# EAGLE design Gadget-Box-PiZero (EAGLE 6.6.0)
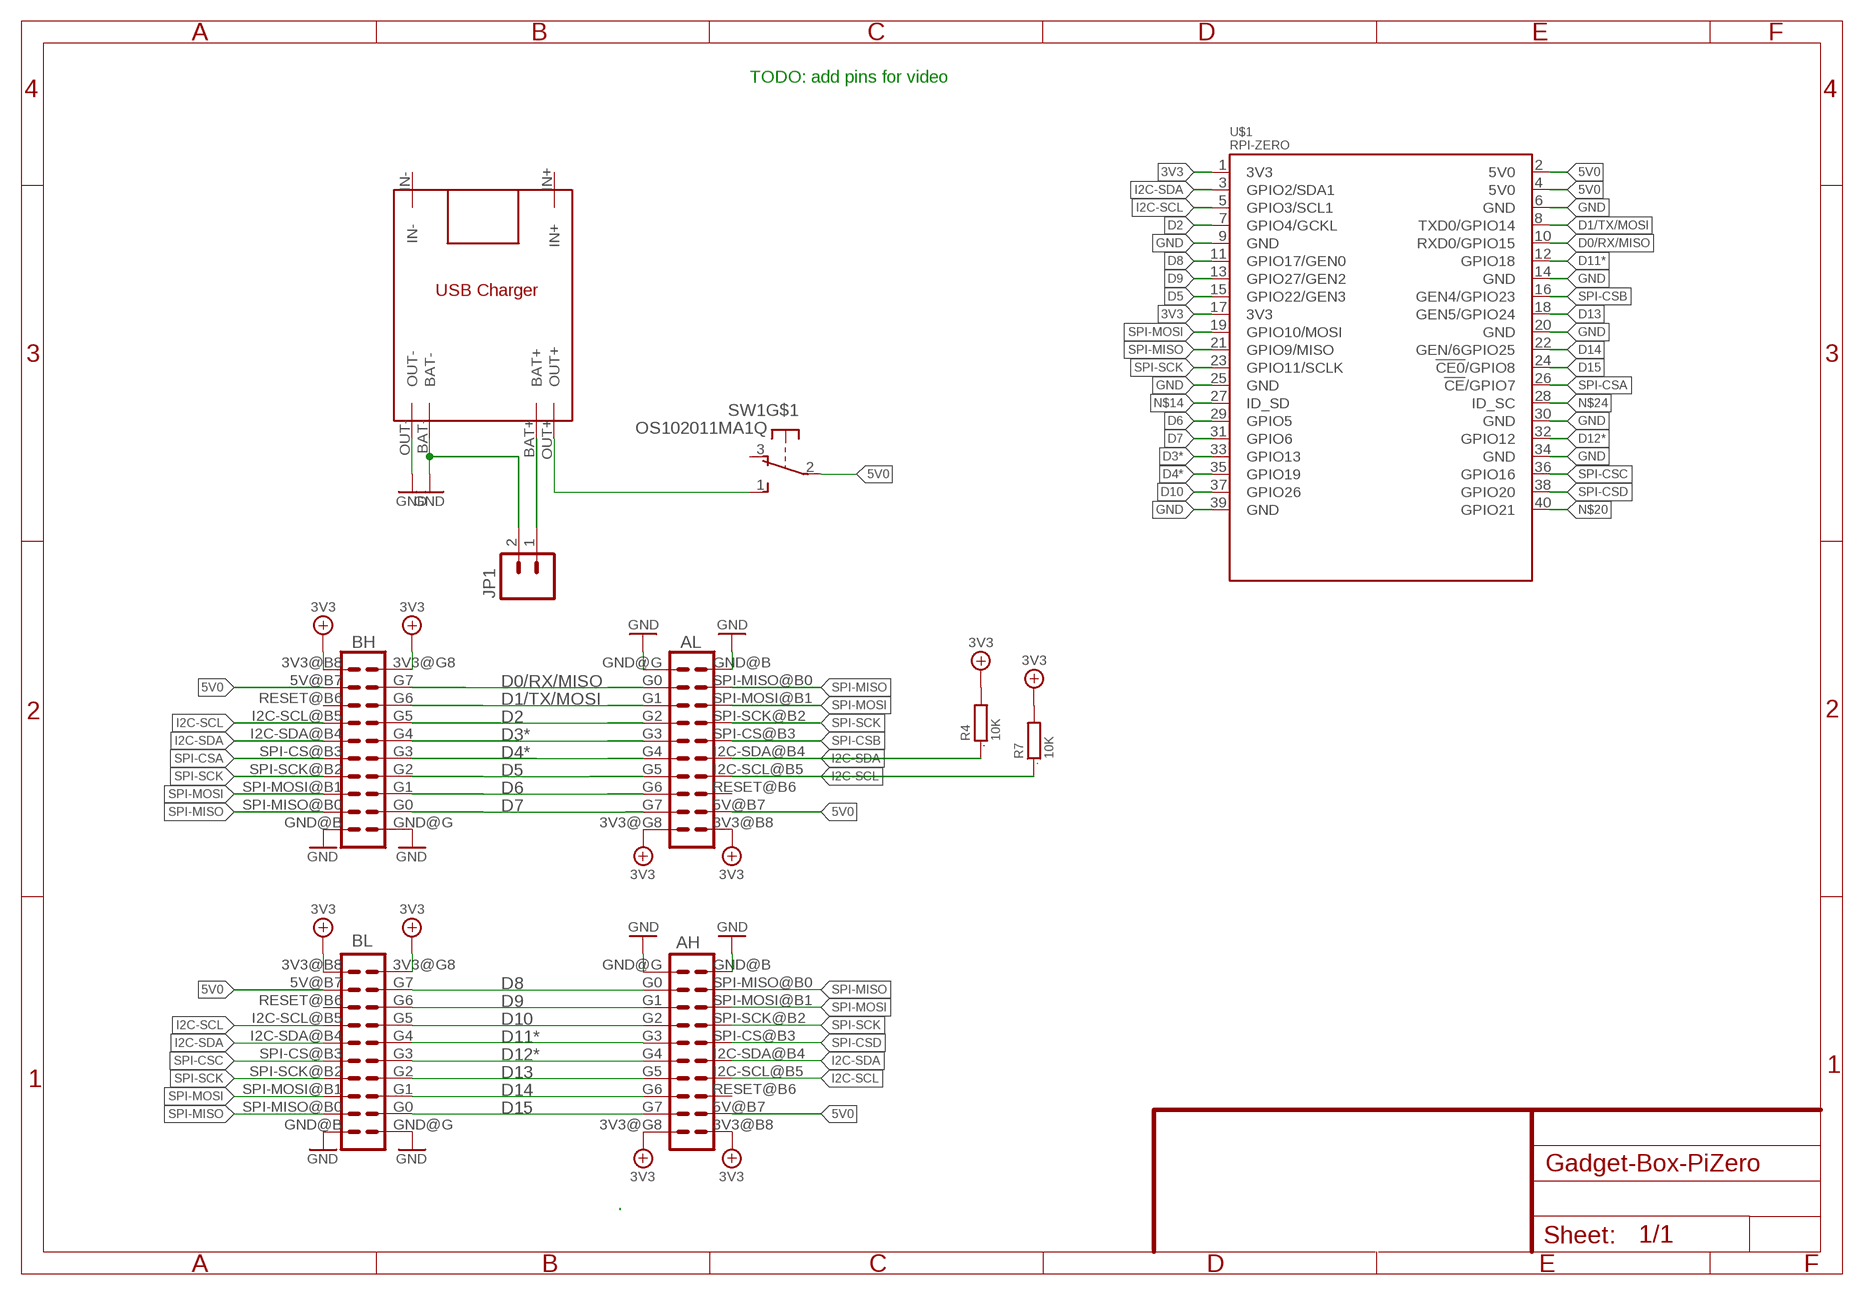
[diagram p0: schematic, sheet 1]

## Parts
AH  ECOGECOG_SLOT_ALT1  [ECOG_ALT1]
AL  ECOGECOG_SLOT_ALT1  [ECOG_ALT1]
BH  ECOGECOG_SLOT_ALT1  [ECOG_ALT1]
BL  ECOGECOG_SLOT_ALT1  [ECOG_ALT1]
JP1  M02-JST-2-PTH-NO_SILK  [JST-2-PTH-NS]
R4  10K  R0603  [0603]
R7  10K  R0603  [0603]
SW1  OS102011MA1Q  [OS102011MA1Q]
U$1  RPI-ZERO  [RASPBERRYPI_BASTELSTUBE_V13_RASPI_BOARD_B+_FULL]
U$2  TP4056  [TP4056]

## Nets
3V3: AH.3V3@B8(3V3) AH.3V3@G8(3V3) AL.3V3@B8(3V3) AL.3V3@G8(3V3) BH.3V3@B8(3V3) BH.3V3@G8(3V3) BL.3V3@B8(3V3) BL.3V3@G8(3V3) R4.2 R7.2 U$1.1(3V3) U$1.17(3V3)
5V0: AH.5V@B7(5V) AL.5V@B7(5V) BH.5V@B7(5V) BL.5V@B7(5V) SW1.2(P) U$1.2(5V0) U$1.4(5V0)
D0/RX/MISO: AL.G0 BH.G7 U$1.10(RXD0/GPIO15)
D1/TX/MOSI: AL.G1 BH.G6 U$1.8(TXD0/GPIO14)
D2: AL.G2 BH.G5 U$1.7(GPIO4/GCKL)
D3*: AL.G3 BH.G4 U$1.33(GPIO13)
D4*: AL.G4 BH.G3 U$1.35(GPIO19)
D5: AL.G5 BH.G2 U$1.15(GPIO22/GEN3)
D6: AL.G6 BH.G1 U$1.29(GPIO5)
D7: AL.G7 BH.G0 U$1.31(GPIO6)
D8: AH.G0 BL.G7 U$1.11(GPIO17/GEN0)
D9: AH.G1 BL.G6 U$1.13(GPIO27/GEN2)
D10: AH.G2 BL.G5 U$1.37(GPIO26)
D11*: AH.G3 BL.G4 U$1.12(GPIO18)
D12*: AH.G4 BL.G3 U$1.32(GPIO12)
D13: AH.G5 BL.G2 U$1.18(GEN5/GPIO24)
D14: AH.G6 BL.G1 U$1.22(GEN/6GPIO25)
D15: AH.G7 BL.G0 U$1.24(!CE0!/GPIO8)
GND [gnd]: AH.GND@B(GND) AH.GND@G(GND) AL.GND@B(GND) AL.GND@G(GND) BH.GND@B(GND) BH.GND@G(GND) BL.GND@B(GND) BL.GND@G(GND) JP1.2 U$1.6(GND) U$1.9(GND) U$1.14(GND) U$1.20(GND) U$1.25(GND) U$1.30(GND) U$1.34(GND) U$1.39(GND) U$2.BAT- U$2.OUT-
I2C-SCL: AH.I2C-SCL@B5(I2C-SCL) AL.I2C-SCL@B5(I2C-SCL) BH.I2C-SCL@B5(I2C-SCL) BL.I2C-SCL@B5(I2C-SCL) R7.1 U$1.5(GPIO3/SCL1)
I2C-SDA: AH.I2C-SDA@B4(I2C-SDA) AL.I2C-SDA@B4(I2C-SDA) BH.I2C-SDA@B4(I2C-SDA) BL.I2C-SDA@B4(I2C-SDA) R4.1 U$1.3(GPIO2/SDA1)
N$2: JP1.1 U$2.BAT+
N$3: SW1.1(S) U$2.OUT+
N$14: U$1.27(ID_SD)
N$20: U$1.40(GPIO21)
N$24: U$1.28(ID_SC)
SPI-CSA: BH.SPI-CS@B3(SPI-CS) U$1.26(!CE!/GPIO7)
SPI-CSB: AL.SPI-CS@B3(SPI-CS) U$1.16(GEN4/GPIO23)
SPI-CSC: BL.SPI-CS@B3(SPI-CS) U$1.36(GPIO16)
SPI-CSD: AH.SPI-CS@B3(SPI-CS) U$1.38(GPIO20)
SPI-MISO: AH.SPI-MISO@B0(SPI-MISO) AL.SPI-MISO@B0(SPI-MISO) BH.SPI-MISO@B0(SPI-MISO) BL.SPI-MISO@B0(SPI-MISO) U$1.21(GPIO9/MISO)
SPI-MOSI: AH.SPI-MOSI@B1(SPI-MOSI) AL.SPI-MOSI@B1(SPI-MOSI) BH.SPI-MOSI@B1(SPI-MOSI) BL.SPI-MOSI@B1(SPI-MOSI) U$1.19(GPIO10/MOSI)
SPI-SCK: AH.SPI-SCK@B2(SPI-SCK) AL.SPI-SCK@B2(SPI-SCK) BH.SPI-SCK@B2(SPI-SCK) BL.SPI-SCK@B2(SPI-SCK) U$1.23(GPIO11/SCLK)
Unconnected: AH.RESET@B6(RESET) AL.RESET@B6(RESET) BH.RESET@B6(RESET) BL.RESET@B6(RESET) SW1.3(O) SW1.MT1(MT) SW1.MT2(MT) U$2.IN+ U$2.IN-

## Notes on the sheet
- TODO: add pins for video

## Library data of the parts
AH AL BH BL = eCogs:ECOG; PARTNO: PPPC102LFBN-RC,SULLINS CONNECTOR SOLUTIONS,dk,S6106-ND,"CONN HEADER FEM 20POS.1"" DL GOLD", REF67
JP1 = SparkFun:M02: Header 2 Standard 2-pin 0.1" header. Use with straight break away headers (SKU : PRT-00116), right angle break away headers (PRT-00553), swiss pins (PRT-00743), machine pins (PRT-00117), and female headers (PRT-00115). Molex polarized connector foot print use with SKU : PRT-08233 with associated crimp pins and housings.
R4 R7 = GadgetFactory:R: RESISTOR, European symbol; PARTNO: RC0603JR-0710KL,YAGEO (VA),dk,311-10KGRCT-ND,RES SMD 10K OHM 5% 1/10W 0603 , REF36
SW1 = adafruit:OS102011MA1Q: OS10201MA1Q through-hole right angle switch http://www.ladyada.net/library/eagle
U$1 = RPI-Zero:RPI-ZERO; BOM: EXCLUDE
U$2 = TP4056 charging module:TP4056

## Net classes
2 gnd: width 0.254 mm, drill 0.381 mm, clearance 0.254 mm
3 usbvcc: width 0.254 mm, drill 0.381 mm, clearance 0.254 mm
4 aref: width 0.254 mm, drill 0.381 mm, clearance 0.254 mm

## Board
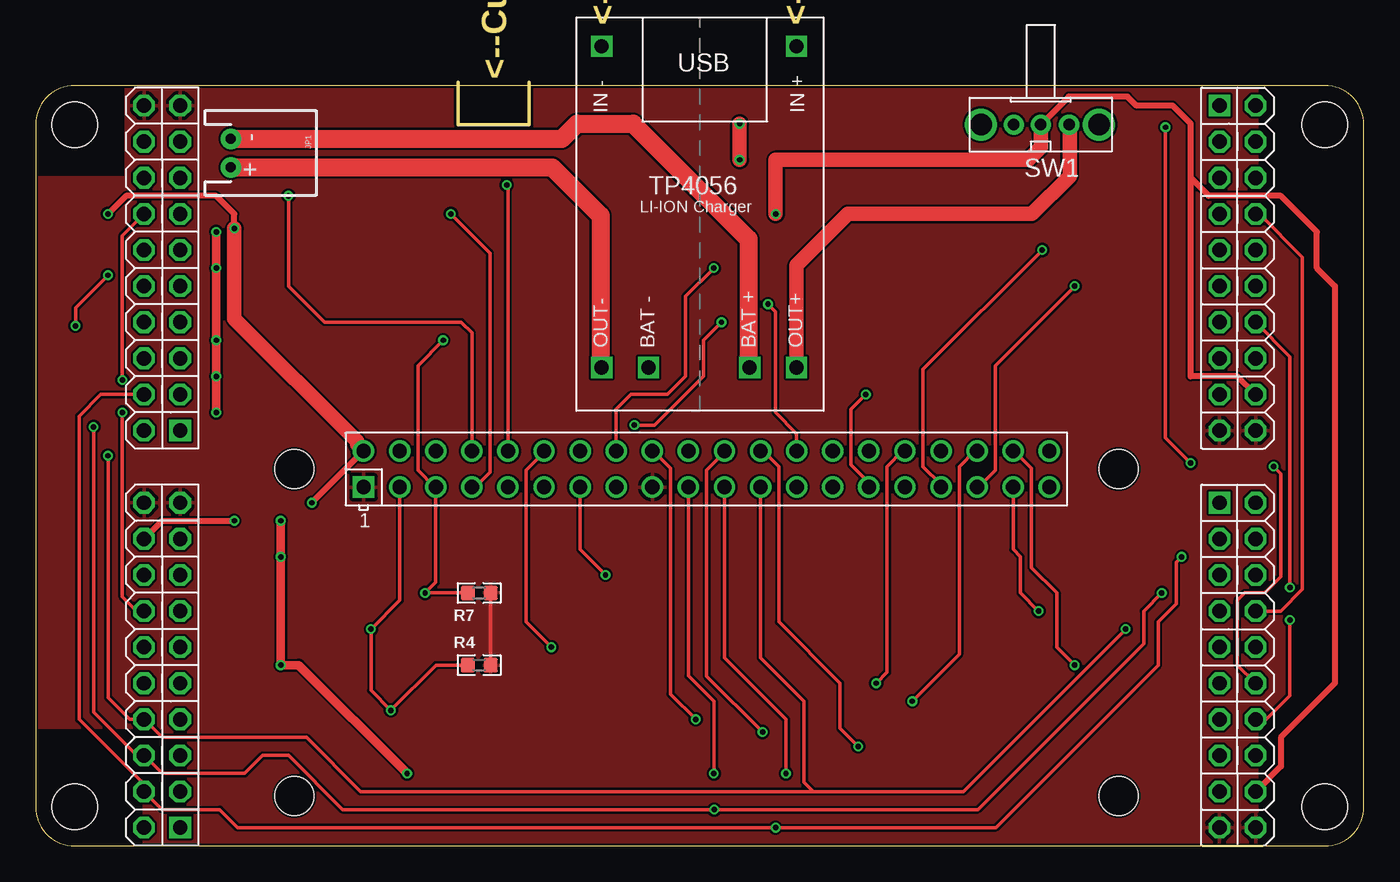
[diagram p1: board, top side]
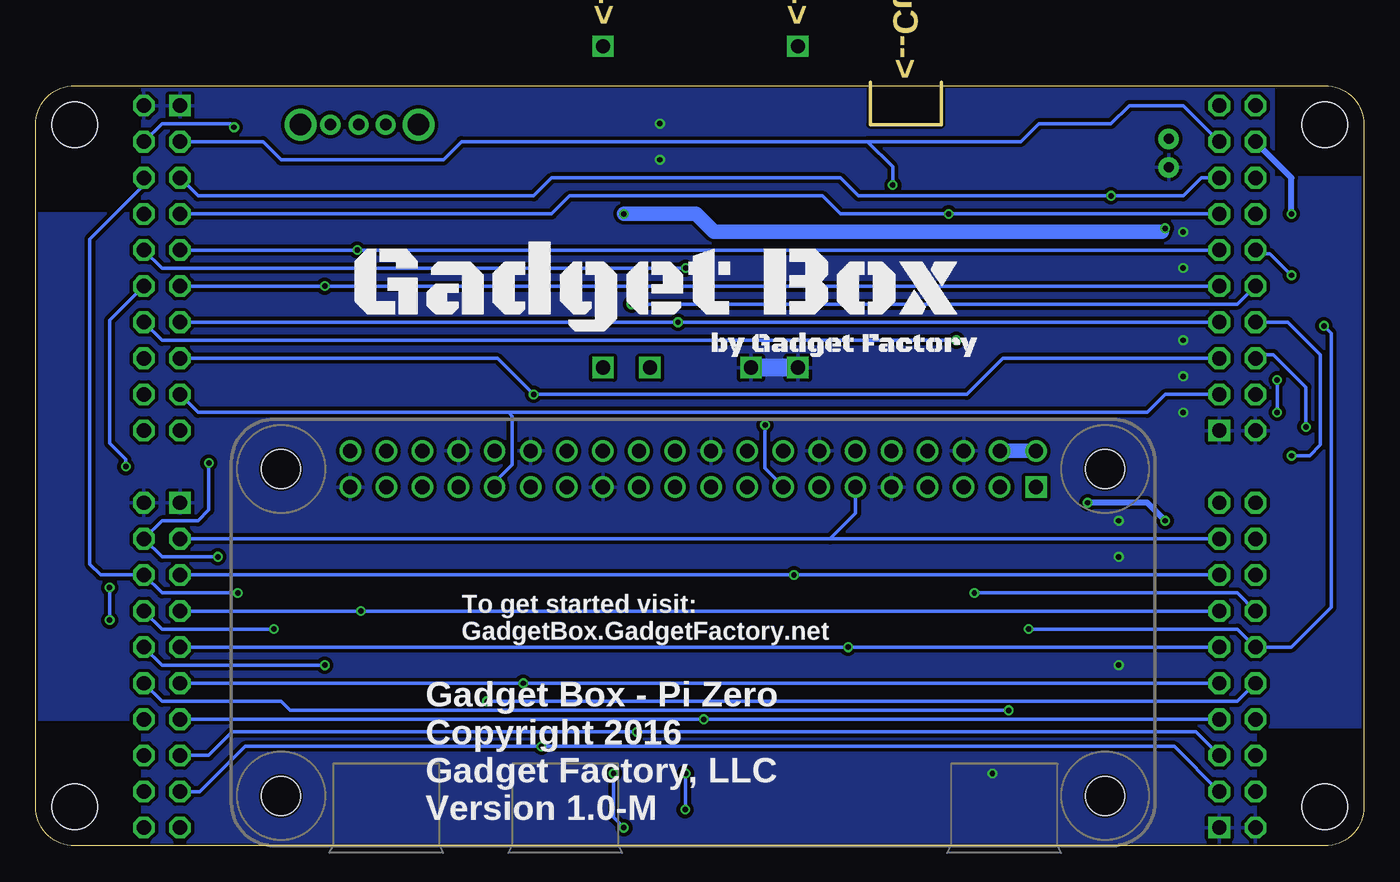
[diagram p2: board, bottom side, seen from below]

Size 93.5 x 53.75 mm. Coordinates in mm from the lower left corner, seen from the top.
Outline: 34.75,53.75 34.75,50.75 29.75,50.75 29.75,53.75
Copper layers (1*16): Top 0.035mm / dielectric 1.5mm / Bottom 0.035mm
Design rules "hackvana *": minimum track width 6mil, minimum drill 0.3mm, track to track 6mil, track to pad 6mil, pad to pad 6mil, via to via 6mil, smd to smd 0mil, copper to edge 6mil, drill to drill 6mil, minimum pad ring 10mil, minimum via ring 6mil, stop-mask expansion 2mil, vias tented up to drill 100mil, thermal gap 10mil

### Footprints (pad centres in the part's own frame; a part is rotated, then mirrored left to right if it is on the bottom)
ECOG93P53P5 = hole 3.2: 4,4; 92,4; 92,52; 4,52
ECOG_ALT1 = drill 1.016 octagon: 3V3@B8 21.59,3.81; 3V3@G8 21.59,1.27; 5V@B7 19.05,3.81; G0 1.27,1.27; G1 3.81,1.27; G2 6.35,1.27; G3 8.89,1.27; G4 11.43,1.27; G5 13.97,1.27; G6 16.51,1.27; G7 19.05,1.27; GND@B -1.27,3.81; I2C-SCL@B5 13.97,3.81; I2C-SDA@B4 11.43,3.81; RESET@B6 16.51,3.81; SPI-CS@B3 8.89,3.81; SPI-MISO@B0 1.27,3.81; SPI-MOSI@B1 3.81,3.81; SPI-SCK@B2 6.35,3.81 | drill 1.016 square: GND@G -1.27,1.27
JST-2-PTH-NS = drill 0.7 pad 1.448: 1 -1,0; 2 1,0
0603 = smd 1 x 1: 1 -0.8,0; 2 0.8,0
OS102011MA1Q = drill 0.8 pad 1.422: 1 -2,0; 2 0,0; 3 1.9,0 | drill 1.5 pad 2.184: MT1 -4.1,0; MT2 4.2,0
RASPBERRYPI_BASTELSTUBE_V13_RASPI_BOARD_B+_FULL = drill 1 square: 1 8.37,25.23 | drill 1: 2 8.37,27.77; 3 10.91,25.23; 4 10.91,27.77; 5 13.45,25.23; 6 13.45,27.77; 7 15.99,25.23; 8 15.99,27.77; 9 18.53,25.23; 10 18.53,27.77; 11 21.07,25.23; 12 21.07,27.77; 13 23.61,25.23; 14 23.61,27.77; 15 26.15,25.23; 16 26.15,27.77; 17 28.69,25.23; 18 28.69,27.77; 19 31.23,25.23; 20 31.23,27.77; 21 33.77,25.23; 22 33.77,27.77; 23 36.31,25.23; 24 36.31,27.77; 25 38.85,25.23; 26 38.85,27.77; 27 41.39,25.23; 28 41.39,27.77; 29 43.93,25.23; 30 43.93,27.77; 31 46.47,25.23; 32 46.47,27.77; 33 49.01,25.23; 34 49.01,27.77; 35 51.55,25.23; 36 51.55,27.77; 37 54.09,25.23; 38 54.09,27.77; 39 56.63,25.23; 40 56.63,27.77 | hole 2.75: 3.5,3.5; 3.5,26.5; 61.5,3.5; 61.5,26.5
TP4056 = drill 1 pad 1.422 square: BAT+ 3.505,-8.89; BAT- -3.607,-8.89; IN+ 6.807,13.716; IN- -6.909,13.716; OUT+ 6.807,-8.89; OUT- -6.909,-8.89

### Placement (x,y rotation side)
$$U$1  [ECOG93P53P5]  -1.25,-1.25 0 top
AH  82.06,22.88 270 top
AL  82.06,50.82 270 top
BH  11.45,30.5 90 top
BL  11.45,2.56 90 top
JP1  13.75,48.75 270 top
R4  31.23,12.72 0 top
R7  31.23,17.8 0 top
SW1  70.75,50.75 180 top
U$1  14.72,0.02 0 top
U$2  46.75,42.55 0 top
U$100  [GADGETBOX_TEXT]  49.77,39.14 0 bottom

### Tracks (layer width: path | path; a pad name or v marks a point on that pad's centre or on a via)
3V3
  Top 0.254: R4.2 R7.2
  pour Top: -1.25,8.37 -1.25,47.03 6.37,47.03 6.37,54.63 85.95,54.63 85.95,45.01 94.92,45.01 94.92,8.37 85.95,8.37 85.95,-1.25 7.64,-1.25 7.64,8.37
5V0  (via drill 0.38)
  Top 0.406: v13.99,43.45 13.99,44.47 12.72,45.74 6.37,45.74 v5.1,44.47 | 81.3,47.01 82.57,45.74 87.65,45.74 90.19,43.2 90.19,40.66 91.46,39.39 91.46,11.45 87.65,7.64 87.65,5.61 AH.5V@B7 | 81.3,47.01 81.3,50.82 80.03,52.09 77.49,52.09 76.86,52.73 72.72,52.73 SW1.2 | BL.5V@B7 8.91,22.88 v13.99,22.88 | v19.45,24.15 U$1.2 | AL.5V@B7 84.6,33.04 81.3,33.04 81.3,47.01
  Top 0.61: 22.63,28.47 22.63,28.25
  Top 1.016: v13.99,43.45 13.99,37.1 22.63,28.47 | 22.63,28.25 U$1.2 | SW1.2 70.75,49.16 69.87,48.28 52.09,48.28 v52.09,44.47
  Bottom 0.406: 14.24,43.2 v13.99,43.45 | v5.1,44.47 5.1,47.01 BH.5V@B7 | v13.99,22.88 15.26,24.15 v19.45,24.15
  Bottom 1.016: U$1.2 U$1.4 | v52.09,44.47 47.01,44.47 45.74,43.2 14.24,43.2
D0/RX/MISO  (via drill 0.38)
  Top 0.254: U$1.10 33.25,46.42 v33.17,46.5
  Bottom 0.254: AL.G0 77.49,49.55 76.22,48.28 64.79,48.28 63.52,49.55 34.95,49.55 | v33.17,46.5 33.17,47.77 34.95,49.55 | BH.G7 12.72,52.09 16.53,52.09 17.8,50.82 22.88,50.82 24.15,49.55 34.95,49.55
D1/TX/MOSI  (via drill 0.38)
  Top 0.254: v17.8,45.74 17.8,39.39 20.34,36.85 29.96,36.85 30.71,36.1 U$1.8
  Bottom 0.254: AL.G1 82.06,45.74 58.44,45.74 57.17,47.01 36.85,47.01 35.58,45.74 v17.8,45.74 12.72,45.74 11.45,47.01 BH.G6
D2  (via drill 0.38)
  Top 0.254: U$1.7 30.93,25.25 31.99,26.31 31.99,41.71 v29.23,44.47
  Bottom 0.254: AL.G2 57.17,44.47 55.9,45.74 38.12,45.74 36.85,44.47 v29.23,44.47 26.69,44.47 BH.G5
D3*  (via drill 0.38)
  Top 0.254: U$1.33 63.73,25.43 62.47,26.69 62.47,33.55 v70.85,41.93
  Bottom 0.254: BH.G4 v70.85,41.93 AL.G3
D4*  (via drill 0.38)
  Top 0.254: U$1.35 66.37,25.25 67.55,26.44 67.55,33.8 v73.14,39.39
  Bottom 0.254: AL.G4 v73.14,39.39 BH.G3
D5  (via drill 0.38)
  Top 0.254: v42.15,29.61 43.58,29.61 47.01,33.04 47.01,35.58 v48.28,36.85
  Bottom 0.254: BH.G2 v48.28,36.85 49.55,36.85 AL.G5 | U$1.15 40.87,25.28 42.15,26.56 v42.15,29.61
D6  (via drill 0.38)
  Top 0.254: U$1.29 58.65,25.56 57.39,26.82 57.39,30.72 v58.44,31.77
  Bottom 0.254: BH.G1 25.42,34.31 27.96,31.77 v58.44,31.77 59.08,32.41 60.98,34.31 AL.G6
D7
  Bottom 0.254: U$1.31 61.19,25.59 59.96,26.82 59.96,30.25 60.22,30.5 | BH.G0 13.99,31.77 15.26,30.5 60.22,30.5 | 60.22,30.5 82.06,30.5 AL.G7
D8
  Top 0.254: U$1.11 35.79,25.28
  Bottom 0.254: BL.G7 37.58,21.61 | 37.58,21.61 AH.G0 | U$1.11 35.79,23.4 37.58,21.61
D9  (via drill 0.38)
  Top 0.254: U$1.13 38.33,20.86 v40.12,19.07
  Bottom 0.254: BL.G6 v40.12,19.07 AH.G1
D10  (via drill 0.38)
  Top 0.254: U$1.37 68.81,20.86 69.33,20.34 69.33,17.8 v70.6,16.53
  Bottom 0.254: AH.G2 v70.6,16.53 BL.G5
D11*  (via drill 0.38)
  Top 0.254: U$1.12 35.79,27.69 34.53,26.44 34.53,15.77 v36.31,13.99
  Bottom 0.254: BL.G4 v36.31,13.99 AH.G3
D12*  (via drill 0.38)
  Top 0.254: U$1.32 61.03,27.79 59.93,26.69 59.93,12.21 v59.17,11.45
  Bottom 0.254: AH.G4 v59.17,11.45 BL.G3
D13  (via drill 0.38)
  Top 0.254: U$1.18 43.47,27.79 44.69,26.56 44.69,10.69 v46.47,8.91
  Bottom 0.254: BL.G2 v46.47,8.91 AH.G5
D14  (via drill 0.38)
  Top 0.254: U$1.22 48.49,27.69 47.23,26.44 47.23,11.96 v51.17,8.02
  Bottom 0.254: AH.G6 81.3,6.37 79.65,8.02 v51.17,8.02 11.83,8.02 BL.G1
D15  (via drill 0.38)
  Top 0.254: U$1.24 51.21,27.79 52.31,26.69 52.31,15.77 56.63,11.45 56.63,8.28 v57.9,7.01
  Bottom 0.254: 10.31,3.83 BL.G0 13.36,7.01 v57.9,7.01 78.76,7.01 81.94,3.83 AH.G7
GND  (via drill 0.38)
  Top 0.61: v17.26,22.88 v17.26,20.34 v17.26,12.72 18.53,12.72 v26.15,5.1 | v12.72,43.2 v12.72,40.66 v12.72,35.58 v12.72,33.04 v12.72,30.5
  Top 1.016: v49.55,48.28 v49.55,50.82
  Top 1.27: JP1.2 36.36,47.75 39.77,44.34 39.77,33.73 U$2.OUT-
  Bottom 1.27: U$2.OUT- U$2.BAT-
  pour Bottom: -1.25,8.4 -1.25,47.01 6.37,47.01 6.37,55.14 85.95,55.14 85.95,44.47 94.92,44.47 94.92,8.91 85.95,8.91 85.95,-1.76 7.64,-1.76 7.64,8.4
I2C-SCL  (via drill 0.38)
  Top 0.254: BL.I2C-SCL@B5 7.13,16.53 6.12,17.55 v6.12,30.5 | v6.12,32.79 6.12,42.95 BH.I2C-SCL@B5 | v28.69,35.58 26.91,33.8 26.91,26.44 28.1,25.25 U$1.5 28.17,18.55 v27.42,17.8 R7.1 | AH.I2C-SCL@B5 86.63,8.91 88.28,10.56 v88.28,15.89 | v88.28,18.18 88.28,34.44 AL.I2C-SCL@B5
  Bottom 0.254: v6.12,30.5 v6.12,32.79 | v27.42,17.8 8.91,17.8 BL.I2C-SCL@B5 | v28.69,35.58 84.6,35.58 AL.I2C-SCL@B5 | v88.28,15.89 v88.28,18.18
I2C-SDA  (via drill 0.38)
  Top 0.254: v2.81,36.6 2.81,37.87 v5.1,40.15 | U$1.3 25.63,17.28 v23.61,15.26 23.61,10.94 v25.01,9.54 28.18,12.72 R4.1 | AH.I2C-SDA@B4 84.6,12.72 84.6,17.29 85.11,17.8 86.51,17.8 87.65,18.94 87.65,26.18 v87.14,26.69
  Bottom 0.254: v2.81,36.6 2.31,36.09 2.31,16.78 5.1,13.99 BL.I2C-SDA@B4 8.91,15.26 v23.61,15.26 | v5.1,40.15 6.62,41.68 7.39,41.68 BH.I2C-SDA@B4 | v25.01,9.54 75.58,9.54 76.22,10.18 84.6,10.18 AH.I2C-SDA@B4 | v87.14,26.69 87.14,27.2 88.28,28.34 88.28,36.98 AL.I2C-SDA@B4
N$2
  Top 1.27: JP1.1 37.05,49.75 38.12,50.82 42.06,50.82 50.19,42.69 50.19,33.73 U$2.BAT+
N$3
  Top 1.016: U$2.OUT+ 53.56,40.86 57.17,44.47 70.12,44.47 72.79,47.14 72.79,50.71 SW1.1
SPI-CSA  (via drill 0.38)
  Top 0.254: U$1.26 53.57,29.02 52.09,30.5 52.09,37.58 v51.55,38.12
  Bottom 0.254: v51.55,38.12 8.91,38.12 BH.SPI-CS@B3
SPI-CSB  (via drill 0.38)
  Top 0.254: U$1.16 40.87,30.71 41.93,31.77 44.47,31.77 45.74,33.04 45.74,38.66 v47.74,40.66
  Bottom 0.254: v47.74,40.66 84.6,40.66 AL.SPI-CS@B3
SPI-CSC  (via drill 0.38)
  Top 0.254: U$1.36 66.11,27.79 65.01,26.69 65.01,13.48 v61.71,10.18
  Bottom 0.254: v61.71,10.18 8.91,10.18 BL.SPI-CS@B3
SPI-CSD  (via drill 0.38)
  Top 0.254: U$1.38 68.86,27.79 70.09,26.56 70.09,19.58 71.87,17.8 71.87,13.99 v73.14,12.72
  Bottom 0.254: v73.14,12.72 84.6,12.72 AH.SPI-CS@B3
SPI-MISO  (via drill 0.38)
  Top 0.254: BH.SPI-MISO@B0 4.59,31.77 3.07,30.25 3.07,8.91 7.64,4.34 BL.SPI-MISO@B0 8.91,2.56 12.97,2.56 14.24,1.29 v52.09,1.29 67.58,1.29 79.01,12.72 79.01,15.77 80.28,17.04 80.28,19.96 v80.67,20.34 | v79.52,50.57 79.52,28.72 v81.3,26.94 | U$1.21 48.49,13.24 52.82,8.91 v52.82,5.1
  Bottom 0.254: AL.SPI-MISO@B0 84.6,50.82 79.78,50.82 v79.52,50.57 | v81.3,26.94 81.3,23.64 82.06,22.88 84.6,22.88 AH.SPI-MISO@B0 84.6,20.34 v80.67,20.34 | v52.82,5.1 52.82,2.02 v52.09,1.29
SPI-MOSI  (via drill 0.38)
  Top 0.254: v79.27,17.8 78,16.53 78,14.24 66.31,2.56 v47.77,2.56 21.61,2.56 17.8,6.37 15.99,6.37 14.72,5.1 8.91,5.1 BL.SPI-MOSI@B1 7.13,6.37 4.08,9.42 v4.08,29.48 | U$1.19 45.95,11.97 47.74,10.18 v47.74,5.1
  Bottom 0.254: v79.27,17.8 84.6,17.8 AH.SPI-MOSI@B1 88.92,19.07 89.68,19.83 89.68,42.69 85.87,46.5 AL.SPI-MOSI@B1 | v4.08,29.48 4.08,32.28 6.37,34.56 7.39,34.56 BH.SPI-MOSI@B1 | v47.74,5.1 47.74,2.59 v47.77,2.56
SPI-SCK  (via drill 0.38)
  Top 0.254: v5.1,27.45 5.1,10.43 6.62,8.91 BL.SPI-SCK@B2 8.91,7.64 19.07,7.64 22.88,3.83 54.75,3.83 | AL.SPI-SCK@B2 86.13,44.47 89.17,41.42 89.17,18.05 87.65,16.53 AH.SPI-SCK@B2 | v76.73,15.26 65.3,3.83 54.75,3.83 | U$1.23 51.03,13.24 54.09,10.18 54.09,4.49 54.75,3.83
  Bottom 0.254: v76.73,15.26 84.6,15.26 AH.SPI-SCK@B2 | v5.1,27.45 3.83,27.45 3.07,28.21 3.07,34.56 5.35,36.85 BH.SPI-SCK@B2

### Text on the board
Dimension: <--Ignore | <--Ignore | <--Cutout
bPlace: To get started visit: / GadgetBox.GadgetFactory.net | Gadget Box - Pi Zero / Copyright 2016 / Gadget Factory, LLC / Version 1.0-M
Reference: TOP Silkscreen is on layer 200